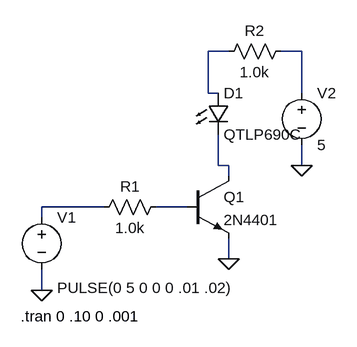
[diagram p0: schematic BJT_Current.asc]
BJT_Current.asc, the LTspice schematic file:
Version 4
SHEET 1 880 680
WIRE 160 -64 128 -64
WIRE 272 -64 240 -64
WIRE 128 0 128 -64
WIRE 144 0 128 0
WIRE 272 0 272 -64
WIRE 144 112 144 64
WIRE 160 112 144 112
WIRE 272 112 272 80
WIRE 160 128 160 112
WIRE -32 176 -128 176
WIRE 96 176 48 176
WIRE -128 192 -128 176
WIRE 160 256 160 224
WIRE -128 304 -128 272
FLAG 160 256 0
FLAG 272 112 0
FLAG -128 304 0
SYMBOL npn 96 128 R0
SYMATTR InstName Q1
SYMATTR Value 2N4401
SYMBOL res 64 160 R90
WINDOW 0 0 56 VBottom 2
WINDOW 3 32 56 VTop 2
SYMATTR InstName R1
SYMATTR Value 1.0k
SYMBOL voltage -128 176 R0
WINDOW 3 24 124 Left 2
WINDOW 123 0 0 Left 0
WINDOW 39 0 0 Left 0
SYMATTR Value PULSE(0 5 0 0 0 .01 .02)
SYMATTR InstName V1
SYMBOL voltage 272 -16 R0
WINDOW 123 0 0 Left 0
WINDOW 39 0 0 Left 0
SYMATTR InstName V2
SYMATTR Value 5
SYMBOL res 256 -80 R90
WINDOW 0 0 56 VBottom 2
WINDOW 3 32 56 VTop 2
SYMATTR InstName R2
SYMATTR Value 1.0k
SYMBOL LED 128 0 R0
SYMATTR InstName D1
SYMATTR Value QTLP690C
TEXT -160 344 Left 2 !.tran 0 .10 0 .001

The netlist it stands for:
* BJT_Current.asc
Q1 N003 N005 0 0 2N4401
R1 N005 N004 1.0k
V1 N004 0 PULSE(0 5 0 0 0 .01 .02)
V2 N002 0 5
R2 N002 N001 1.0k
D1 N001 N003 QTLP690C
.model D D
.lib standard.dio
.model NPN NPN
.model PNP PNP
.lib standard.bjt
.tran 0 .10 0 .001
.backanno
.end